# EAGLE schematic selfbus_dap_debugger (EAGLE 9.6.2)
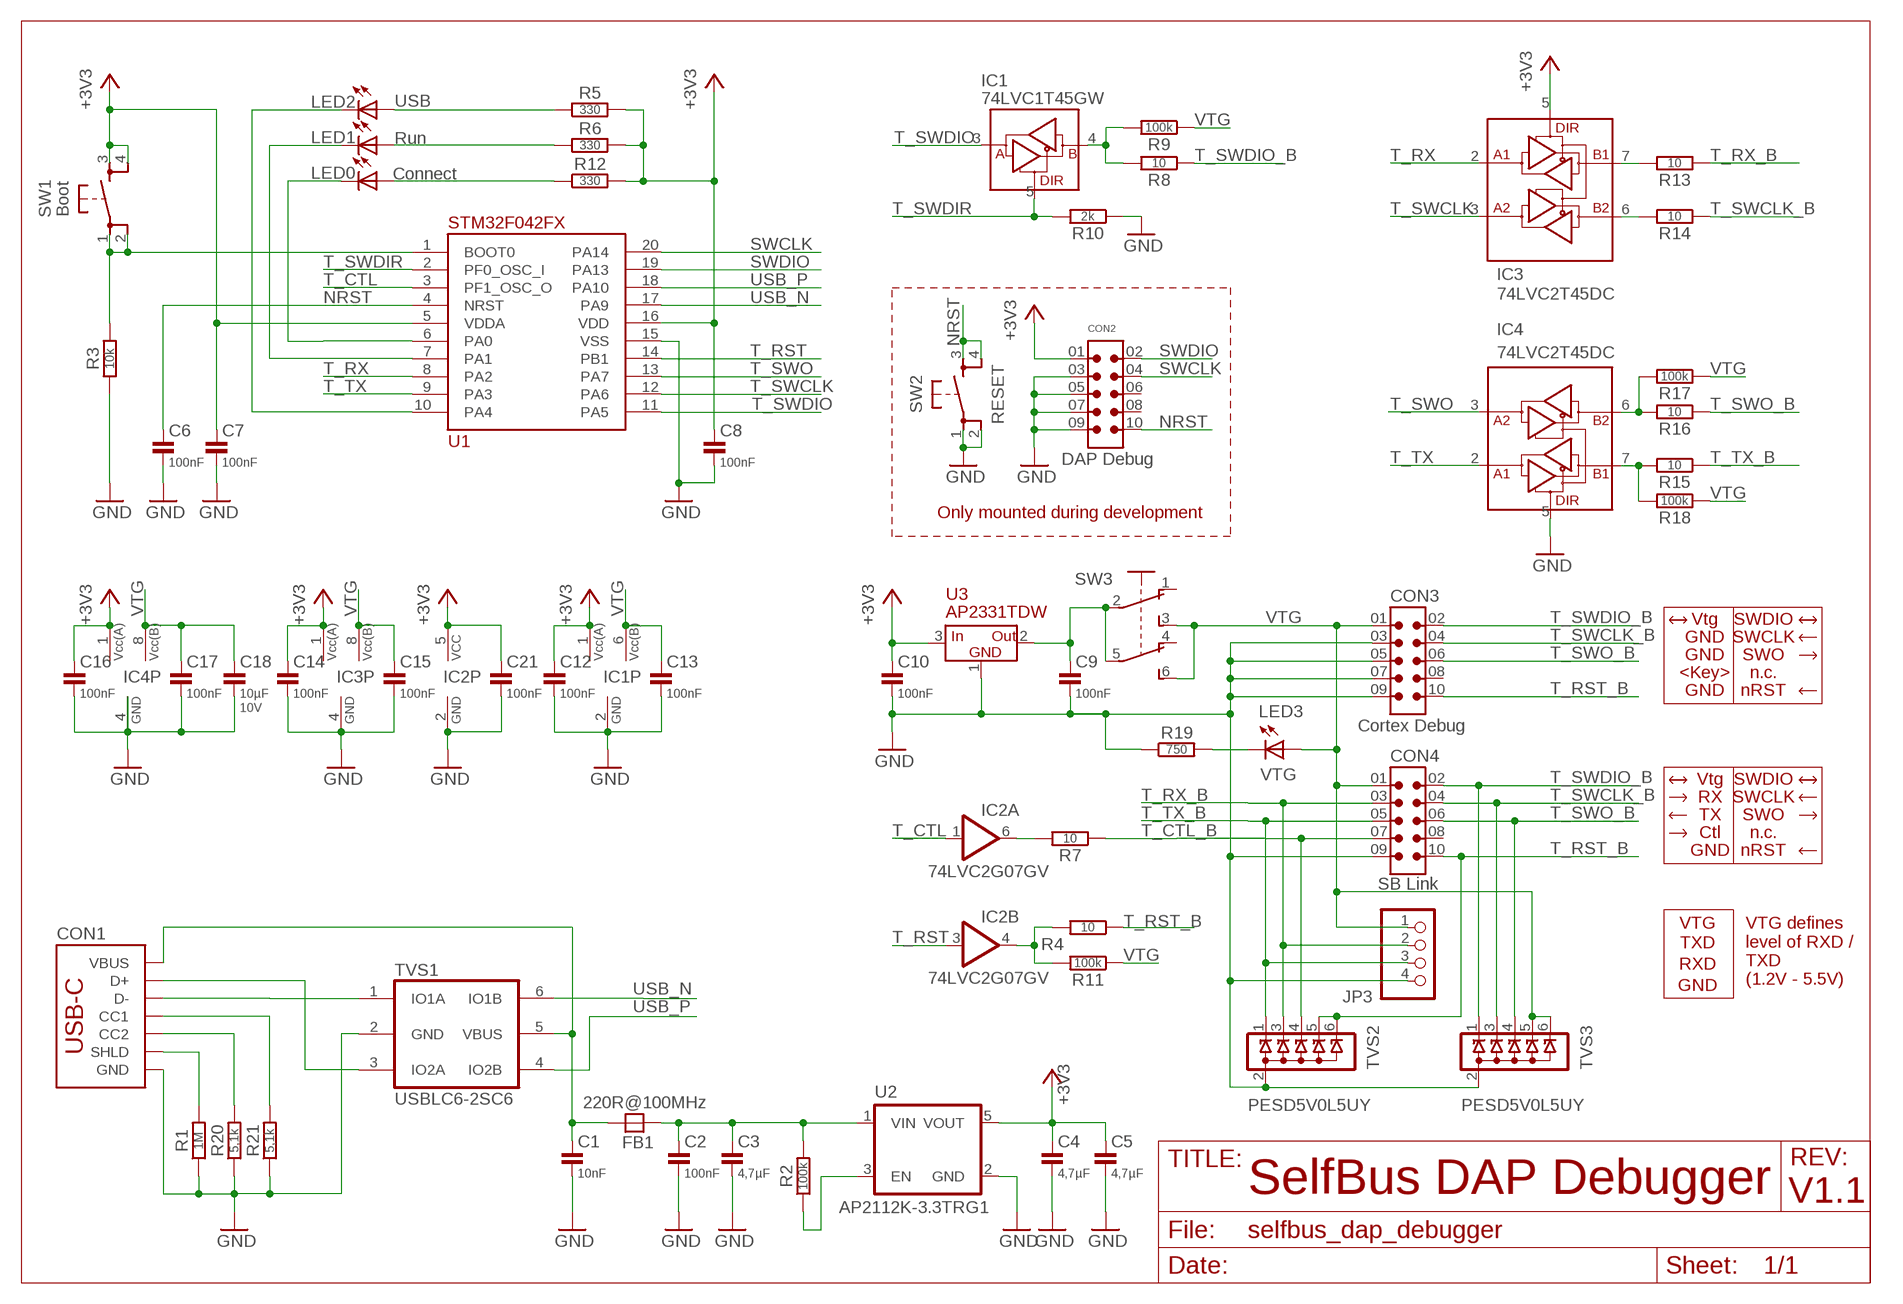
[diagram p0: schematic, sheet 1]

## Parts
C1  10nF  C-EUC0805  [C0805]
C2  100nF  C-EUC0805  [C0805]
C3  4,7µF  C-EUC0805  [C0805]
C4  4,7µF  C-EUC0805  [C0805]
C5  4,7µF  C-EUC0805  [C0805]
C6  100nF  C-EUC0805  [C0805]
C7  100nF  C-EUC0805  [C0805]
C8  100nF  C-EUC0805  [C0805]
C9  100nF  C-EUC0805  [C0805]
C10  100nF  C-EUC0805  [C0805]
C12  100nF  C-EUC0805  [C0805]
C13  100nF  C-EUC0805  [C0805]
C14  100nF  C-EUC0805  [C0805]
C15  100nF  C-EUC0805  [C0805]
C16  100nF  C-EUC0805  [C0805]
C17  100nF  C-EUC0805  [C0805]
C18  10µF  C-EUC0805  [C0805]
C21  100nF  C-EUC0805  [C0805]
CON1  XKB U262-161N-4BVC11  USB_C_2-LAYER_PADS  [USB-C-16P-2LAYER-PADS]
CON2  SHF-105-01-X-D-TH  [SAMTEC_SHF-105-01-X-D-TH]
CON3  SHF-105-01-X-D-TH  [SAMTEC_SHF-105-01-X-D-TH]
CON4  SAMTEC-LTMM-105-02-T-D  [SAMTEC-LTMM-105-02-T-D]
FB1  220R@100MHz  FB  [FB0805]
IC1  74LVC1T45GW  [SOT363]
IC2  74LVC2G07GV  [SOT23-6]
IC3  74LVC2T45DC  [VSSOP8(0.5)]
IC4  74LVC2T45DC  [VSSOP8(0.5)]
JP3  PINHD-1X4  [1X04]
LED0  Connect  LED_3MM(T1)_GREEN  [LED_3MM_GREEN]
LED1  Run  LED_3MM(T1)_YELLOW  [LED_3MM_YELLOW]
LED2  USB  LED_3MM(T1)_GREEN  [LED_3MM_GREEN]
LED3  VTG  LED_3MM(T1)_RED  [LED_3MM_RED]
R1  1M  R-EU_R0805  [R0805]
R2  100k  R-EU_R0805  [R0805]
R3  10k  R-EU_R0805  [R0805]
R4  10  R-EU_R0805  [R0805]
R5  330  R-EU_R0805  [R0805]
R6  330  R-EU_R0805  [R0805]
R7  10  R-EU_R0805  [R0805]
R8  10  R-EU_R0805  [R0805]
R9  100k  R-EU_R0805  [R0805]
R10  2k  R-EU_R0805  [R0805]
R11  100k  R-EU_R0805  [R0805]
R12  330  R-EU_R0805  [R0805]
R13  10  R-EU_R0805  [R0805]
R14  10  R-EU_R0805  [R0805]
R15  10  R-EU_R0805  [R0805]
R16  10  R-EU_R0805  [R0805]
R17  100k  R-EU_R0805  [R0805]
R18  100k  R-EU_R0805  [R0805]
R19  750  R-EU_R0805  [R0805]
R20  5,1k  R-EU_R0805  [R0805]
R21  5,1k  R-EU_R0805  [R0805]
SW1  BOOT  ALPS_SKHHDHA010  [TACT_SWITCH_6X6_SNAP-IN_17]
SW2  RESET  ALPS_SKHHDHA010  [TACT_SWITCH_6X6_SNAP-IN_17]
SW3  XKB7070-Z  [XKB7070]
TVS1  USBLC6-2SC6  [SOT-23-6L]
TVS2  PESD5V0L5UY  [SOT363]
TVS3  PESD5V0L5UY  [SOT363]
U1  STM32F042FX  [TSSOP20]
U2  AP2112K-3.3TRG1  [SOT23-5]
U3  AP2331TDW  [SC59]

## Nets
+3V3: C4.1 C5.1 C7.1 C8.1 C10.1 C12.1 C14.1 C16.1 C21.1 CON2.01 IC1.1(VCC(A)) IC2.5(P:VCC) IC3.1(VCC(A)) IC3.5(DIR) IC4.1(VCC(A)) R5.2 R6.2 R12.2 SW1.3 SW1.4 U1.5(VDDA) U1.16(VDD) U2.5(VOUT) U3.3(IN)
D_N [USB]: CON1.A7(D-) CON1.B7(D-) TVS1.1(IO1A)
D_P [USB]: CON1.A6(D+) CON1.B6(D+) TVS1.3(IO2A)
GND: C1.2 C2.2 C3.2 C4.2 C5.2 C6.2 C7.2 C8.2 C9.2 C10.2 C12.2 C13.2 C14.2 C15.2 C16.2 C17.2 C18.2 C21.2 CON1.GND CON1.GND2(GND) CON2.03 CON2.05 CON2.07 CON2.09 CON3.03 CON3.05 CON3.07 CON3.09 CON4.09 IC1.2(GND) IC2.2(P:GND) IC3.4(GND) IC4.4(GND) IC4.5(DIR) JP3.4 R1.1 R3.1 R10.1 R19.1 R20.1 R21.1 SW2.1 SW2.2 TVS1.2(GND) TVS2.2(A) TVS3.2(A) U1.15(VSS) U2.2(GND) U3.1(GND)
LED0: LED0.C U1.6(PA0)
LED1: LED1.C U1.7(PA1)
N$2: CON1.SHLD1(SHLD) CON1.SHLD2(SHLD) CON1.SHLD3(SHLD) CON1.SHLD4(SHLD) R1.2
N$3: CON1.B5(CC2) R20.2
N$5: CON1.A5(CC1) R21.2
N$6: R2.1 U2.3(EN)
N$7: C2.1 C3.1 FB1.2 R2.2 U2.1(VIN)
N$8: IC2.4(B:OUT) R4.2 R11.2
N$9: IC2.6(A:OUT) R7.2
N$10: R3.2 SW1.1 SW1.2 U1.1(BOOT0)
N$11: LED2.A R5.1
N$12: LED1.A R6.1
N$15: C9.1 SW3.2(P) SW3.5(P) U3.2(OUT)
N$17: LED0.A R12.1
N$18: IC3.7(B1) R13.2
N$19: IC3.6(B2) R14.2
N$20: IC4.6(B2) R16.2 R17.2
N$21: IC4.7(B1) R15.2 R18.2
N$22: IC1.4(B) R8.2 R9.2
N$23: LED2.C U1.10(PA4)
N$24: LED3.C R19.2
NRST: C6.1 CON2.10 SW2.3 SW2.4 U1.4(NRST)
SWCLK: CON2.04 U1.20(PA14)
SWDIO: CON2.02 U1.19(PA13)
T_CTL: IC2.1(A:IN) U1.3(PF1_OSC_O)
T_CTL_B: CON4.07 R7.1 TVS2.4(C3)
T_RST: IC2.3(B:IN) U1.14(PB1)
T_RST_B: CON3.10 CON4.10 R4.1 TVS2.5(C4) TVS2.6(C5)
T_RX: IC3.2(A1) U1.8(PA2)
T_RX_B: CON4.03 JP3.2 R13.1 TVS2.3(C2)
T_SWCLK: IC3.3(A2) U1.12(PA6)
T_SWCLK_B: CON3.04 CON4.04 R14.1 TVS3.3(C2)
T_SWDIO: IC1.3(A) U1.11(PA5)
T_SWDIO_B: CON3.02 CON4.02 R8.1 TVS3.1(C1)
T_SWDIR: IC1.5(DIR) R10.2 U1.2(PF0_OSC_I)
T_SWO: IC4.3(A2) U1.13(PA7)
T_SWO_B: CON3.06 CON4.06 R16.1 TVS3.4(C3)
T_TX: IC4.2(A1) U1.9(PA3)
T_TX_B: CON4.05 JP3.3 R15.1 TVS2.1(C1)
USB_N [USB]: TVS1.6(IO1B) U1.17(PA9)
USB_P [USB]: TVS1.4(IO2B) U1.18(PA10)
VBUS: C1.1 CON1.VBUS1(VBUS) CON1.VBUS2(VBUS) FB1.1 TVS1.5(VBUS)
VTG: C13.1 C15.1 C17.1 C18.1 CON3.01 CON4.01 IC1.6(VCC(B)) IC3.8(VCC(B)) IC4.8(VCC(B)) JP3.1 LED3.A R9.1 R11.1 R17.1 R18.1 SW3.3(S) SW3.6(S) TVS3.5(C4) TVS3.6(C5)
Unconnected: CON2.06 CON2.08 CON3.08 CON4.08 SW3.1(O) SW3.4(O)

## Notes on the sheet
- Boot
- RESET
- DAP Debug
- Only mounted during development
- Vtg | SWDIO
- GND | SWCLK
- GND | SWO
- <Key> | n.c.
- GND | nRST
- Cortex Debug
- Vtg | SWDIO
- RX | SWCLK
- TX | SWO
- Ctl | n.c.
- GND | nRST
- SB Link
- VTG defines
  level of RXD /
  TXD
  (1.2V - 5.5V)
- VTG
- TXD
- RXD
- GND
- SelfBus DAP Debugger | V1.1

## Library data of the parts
C1-C10 C12-C17 C21 = MyRCL:C-EU: CAPACITOR, European symbol; SPICEPREFIX: C
C18 = MyRCL:C-EU: CAPACITOR, European symbol; SPICEPREFIX: C; VOLTAGE: 10V
CON1 = MyCon-USB:USB_C: USB Type C 16Pin Connector Super Speed pins not available on the 16-pin purely SMD connector so this part is best for USB 2.0 implementations. D1 and D2 are tied together enabling D+/- no matter which way the cable is plugged into the connector. The two channel configuration pins (CC1/2) are exposed. These are normally connected to ground via 5.1k resistors but can be reconfigured for high current/high power applications. IMPORTANT: Only use for 2-layer boards!; LSSC#: C319148
CON2 CON3 = MyCon-Samtec:SHF-105-01-X-D-TH: Connector Header Through Hole 10 position 0.050" (1.27mm)
CON4 = MyCon-Samtec:SAMTEC-LTMM-105-02-T-D
FB1 = MyEMC-Components:FB: FERRITE BEAD; LCSC#2: C139188; MOUSER#: 810-MPZ2012S221ATD25; PART#: MPZ2012S221ATD25; PART#2: CBW201209U221T; PART_MFR: TDK; PART_MFR2: FH
IC1 = MyIC-Logic:74*1T45: 74LVC1T45; 74LVCH1T45 Dual supply translating transceiver; 3-state Single bit, dual supply transceiver with 3-state output for bidirectional level translation. 74LVCH1T45 holds unused or floating data inputs at a valid logiclevel. Datasheet <https://assets.nexperia.com/documents/data-sheet/74LVC_LVCH1T45.pdf>; LCSC#: C478004; LCSC#2: C548484; LCSC#3: C9382; MOUSER#: 771-74LVC1T45GW125; MOUSER#2: 771-74LVC1T45GWQ100H; MOUSER#3: 595-74LVC1T45QDCKRQ1; PART#: 74LVC1T45GW,125; PART#2: 74LVC1T45GW-Q100H; PART#3: SN74LVC1T45DCKR; PART_MFR: NXP; PART_MFR2: NXP; PART_MFR3: TI
IC2 = MyIC-Logic:74*2G07: Double Buffer/Driver with Open-Drain Output; LCSC#: C548568; MOUSER#: 771-LVC2G07GV125; PART#: 74LVC2G07GV,125; PART_MFR: NXP
IC3 = MyIC-Logic:74*2T45: 74LVC2T45; 74LVCH2T45 Dual supply translating transceiver; 3-state Dual bit, dual supply transceiver with 3-state output for bidirectional level translation. 74LVCH2T45 holds unused or floating data inputs at a valid logiclevel. Datasheet <https://assets.nexperia.com/documents/data-sheet/74LVC_LVCH2T45.pdf>; LCSC#: C15741; LCSC#2: C139524; MOUSER#: 595-SN74LVC2T45DCUT; MOUSER#2: 771-74LVCH2T45DC125; PART#: SN74LVC2T45DCU; PART#2: 74LVCH2T45DC,125; PART_MFR: TI; PART_MFR2: NXP
IC4 = MyIC-Logic:74*2T45: 74LVC2T45; 74LVCH2T45 Dual supply translating transceiver; 3-state Dual bit, dual supply transceiver with 3-state output for bidirectional level translation. 74LVCH2T45 holds unused or floating data inputs at a valid logiclevel. Datasheet <https://assets.nexperia.com/documents/data-sheet/74LVC_LVCH2T45.pdf>
JP3 = pinhead:PINHD-1X4: PIN HEADER
LED0 LED2 = SelfBus DAP Debugger:LED_3MM(T1)_GREEN
LED1 = SelfBus DAP Debugger:LED_3MM(T1)_YELLOW
LED3 = SelfBus DAP Debugger:LED_3MM(T1)_RED
R1-R21 = MyRCL:R-EU_: RESISTOR, European symbol
SW1 SW2 = MyTactSwitch:ALPS_SKHH: Tactile Switch 6x6mm Snap-in ALPS SKHH Series <https://tech.alpsalpine.com/prod/e/html/tact/snapin/skhh/skhh_list.html>; LCSC#: C139811; MOUSER#: 688-SKHHDHA010; PART#: SKHHDHA010; PART_MFR: ALPS
SW3 = MyPushSwitch:XKB7070-Z: Latching Push Switch 70x70mm 12.6mm height Datasheet <https://datasheet.lcsc.com/lcsc/2002271810_XKB-Enterprise-XKB7070-Z_C318863.pdf>
TVS1 = usblc6:USBLC6-2: Very low capacitance ESD protection 2 line Features 2 data-line protection Protects V BUS Very low capacitance: 3.5 pF Very low leakage current: 150 nA SOT-666 and SSOT23-6L package RoHS compliant Datasheet <https://www.st.com/resource/en/datasheet/usblc6-2.pdf>; LCSC#2: C2687116; MOUSER#: 511-USBLC6-2SC6; PART#: USBLC6-2SC6; PART#2: USBLC6-2SC6; PART_MFR: STMicroelectronics; PART_MFR2: UMW
TVS2 = MyESD:PESD5V0L5: Low capacitance unidirectional fivefold ESD protection diode array VBR = 6.8V Datasheet <https://assets.nexperia.com/documents/data-sheet/PESDXL5UF_V_Y.pdf>; LCSC#: C179747; MOUSER#: 771-PESD5V0L5UY-T/R; PART#: PESD5V0L5UY; PART_MFR: NXP
TVS3 = MyESD:PESD5V0L5: Low capacitance unidirectional fivefold ESD protection diode array VBR = 6.8V Datasheet <https://assets.nexperia.com/documents/data-sheet/PESDXL5UF_V_Y.pdf>
U1 = STM32F042Fx:STM32F042FX: STM32F042Fx microcontroller; LCSC#: C81002; LCSC#2: C81000; MOUSER#: 511-STM32F042F4P6; MOUSER#2: 511-STM32F042F6P6TR; PART#: STM32F042F4P6; PART#2: STM32F042F6P6; PART_MFR: STMicroelectronics
U2 = MyIC-Regulator:AP2112: AP2112 - 600mA CMOS LDO Regulator with Enable The AP2112 is CMOS process low dropout linear regulator with enable function, the regulator delivers a guaranteed 600mA (min.) continuous load current. Features Output Voltage Accuracy: ±1.5% Output Current: 600mA (Min.) Foldback Short Current Protection: 50mA Enable Function to Turn ON/OFF VOUT Low Dropout Voltage (3.3V): 250mV (Typ.) @IOUT=600mA Excellent Load Regulation: 0.2%/A (Typ.) Excellent Line Regulation: 0.02%/V (Typ.) Low Quiescent Current: 55μA (Typ.) Low Standby Current: 0.01μA (Typ.) Low Output Noise: 50μVRMS PSRR: 100Hz -65dB, 1kHz -65dB OTSD Protection Stable with 1.0μF Flexible Cap: Ceramic, Tantalum and Aluminum Electrolytic Operation Temperature Range: -40°C to 85°C ESD: MM 400V, HBM 4000V; LCSC#: C51118; LCSC#2: C47719; LCSC#3: C296224; MOUSER#: 621-AP2112K-3.3TRG1; MOUSER#2: 865-XC6210B332MR-G; PART#: AP2112K-3.3TRG1; PART#2: XC6210B332MR-G; PART#3: HX6211A332MR
U3 = MyIC-other:AP2331TD: 0.2A Single Channel Current-limited Loads Switch with Output Transient Discharge Quick Turn-off of Output Discharge Path at Power Down Input Voltage Range: 2.7V to 5.2V Fast Short-Circuit Response Time 0.4A Accurate Current Limiting 250mΩ On-Resistance Reverse-Current Blocking Built-In Soft-Start with 0.7ms Typical Turn-On Time Over-Current Protection Over-Voltage Protection Short-Circuit and Thermal Protection ESD Protection: 3kV HBM, 300V MM Ambient Temperature Range: -40°C to +85°C; LCSC#: C460346; MOUSER#: 621-AP2331W-7; PART#: AP2331W-7; PART_MFR: Diodes

## Net classes
1 USB: width 0.254 mm, clearance 0.102 mm